# Altium project PCB_Project_Wireless Temp.PrjPcb
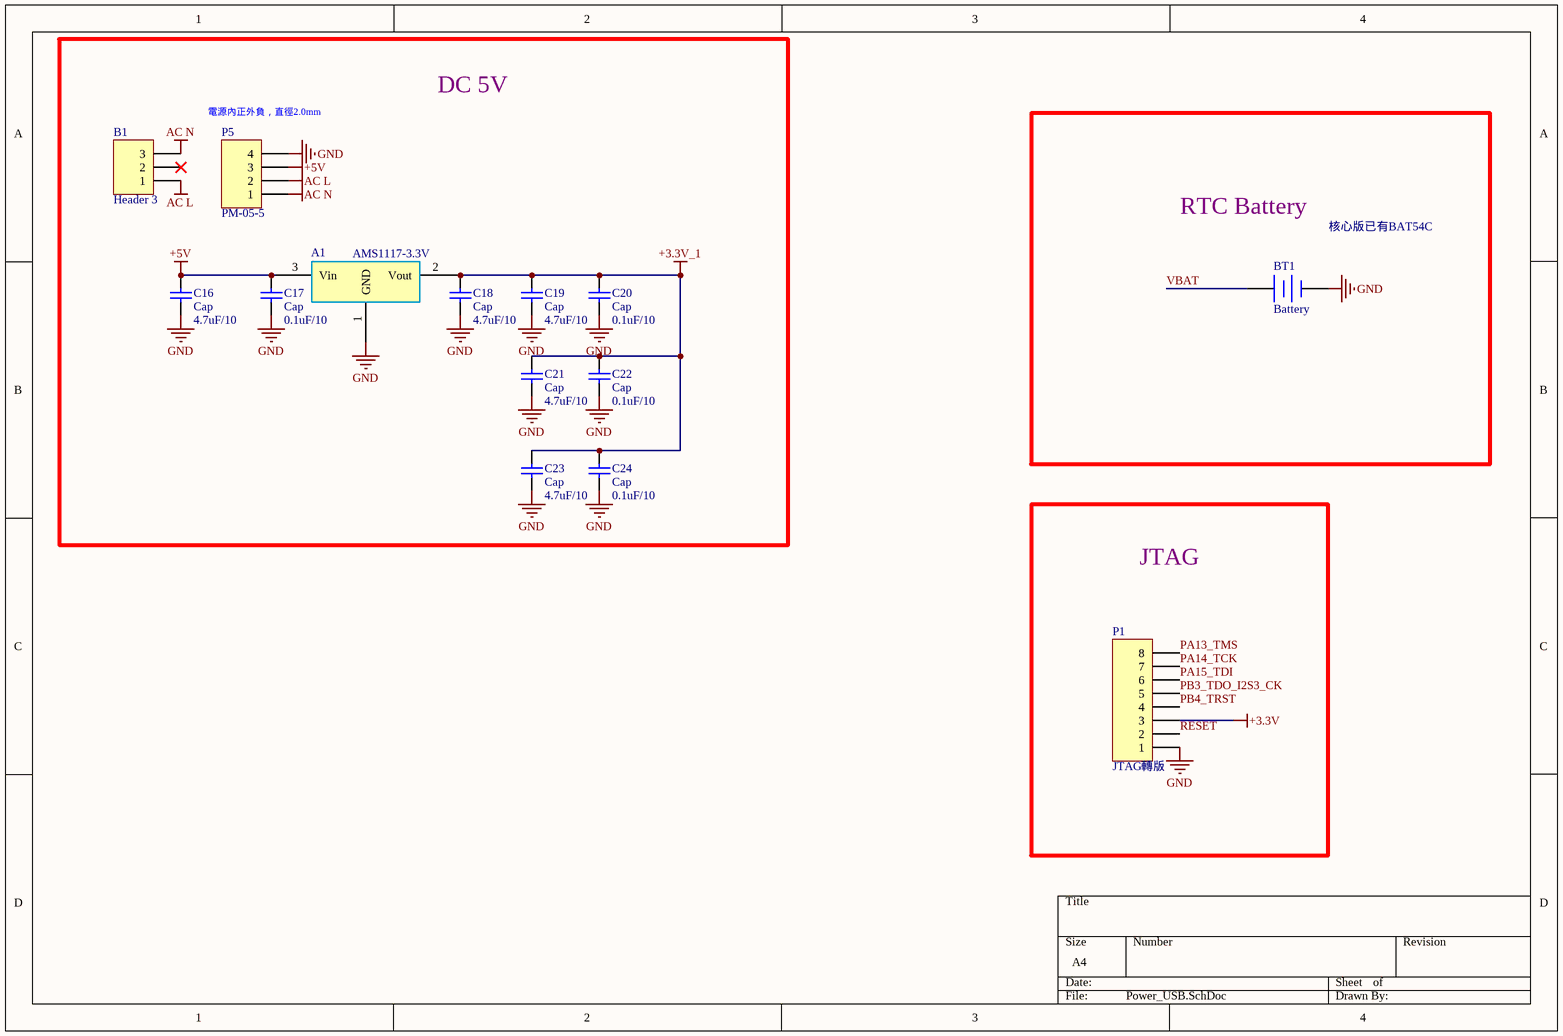
[diagram p0: Power_USB.SchDoc]
5 sheets, 74 parts. Net scope: global (net labels, ports and power ports of the same name join across sheets).
Board file: Wireless Temp PCB.PcbDoc
Sheets:
  Power_USB.SchDoc
  main.SchDoc
  LCD_Button_LED.SchDoc
  RS232_485_SDcard.SchDoc
  LwIP.SchDoc

## Sheet Power_USB.SchDoc
size A4; PageSetup: Record=PageOptions|CenterHorizontal=True|CenterVertical=True|PrintScale=0.91|XCorrection=1.00|YCorrection=1.00|PrintKind=1|BorderSize=5000000|LeftOffset=0|BottomOffset=0|Orientation=2|PaperLength=1000|PaperWidth=1000|Scale=100|PaperSource=15|PrintQuality=600|MediaType=1|DitherType=10|PrintScaleMode=1|PaperKind=Letter

### Parts
A1  AMS1117-3.3V  [AMS1117-3.3]
B1  Header 3  [歐式端子*3p]
BT1  Battery  [CR1220 battery holder]
C16  Cap  value 4.7uF/10  [0805]
C17  Cap  value 0.1uF/10  [0805]
C18  Cap  value 4.7uF/10  [0805]
C19  Cap  value 4.7uF/10  [0805]
C20  Cap  value 0.1uF/10  [0805]
C21  Cap  value 4.7uF/10  [0805]
C22  Cap  value 0.1uF/10  [0805]
C23  Cap  value 4.7uF/10  [0805]
C24  Cap  value 0.1uF/10  [0805]
P1  JTAG轉版  [HDR1X8]
P5  PM-05-5  [MW PM-05-5]

### Blocks framed on the sheet
DC 5V: A1 B1 C16-C24 P5
RTC Battery: BT1
JTAG: P1

### Nets
+3.3V: P1.3
+3.3V_1: A1.2(Vout) C18.1 C19.1 C20.1 C21.1 C22.1 C23.1 C24.1
+5V: A1.3(Vin) C16.1 C17.1 P5.3  [project net R1_V]
AC L: B1.1 P5.2
AC N: B1.3 P5.1
GND: A1.1(GND) BT1.2(-) C16.2 C17.2 C18.2 C19.2 C20.2 C21.2 C22.2 C23.2 C24.2 P1.1 P5.4
PA13_TMS: P1.8
PA14_TCK: P1.7
PA15_TDI: P1.6
PB3_TDO_I2S3_CK: P1.5
PB4_TRST: P1.4
RESET: P1.2
VBAT: BT1.1(+)

Not connected (* = marked no-connect by the designer): B1 2*

### Notes on the sheet
- (near P5) 電源內正外負，直徑2.0mm
- 核心版已有BAT54C

### Library data of the parts
B1 = Header 3: Header, 3-Pin; LatestRevisionDate: 17-Jul-2002; LatestRevisionNote: Re-released for DXP Platform.; Publisher: Altium Limited
BT1 = Battery: Multicell Battery; Published: 24-Mar-1999; LatestRevisionDate: 17-Jul-2002; LatestRevisionNote: Re-released for DXP Platform.; PackageReference: BAT-2; Publisher: Altium Limited; PackageDescription: Battery; 2 Leads
C16-C24 = Cap: Capacitor; Published: 8-Jun-2000; LatestRevisionDate: 17-Jul-2002; LatestRevisionNote: Re-released for DXP Platform.; PackageReference: RAD-0.3; Publisher: Altium Limited; PackageDescription: Radial Cap, Thru-Hole; 2 Leads; 0.3 in Pin Spacing
P1 = Header 8: Header, 8-Pin; LatestRevisionDate: 17-Jul-2002; LatestRevisionNote: Re-released for DXP Platform.; Publisher: Altium Limited
P5 = Header 4: Header, 4-Pin; LatestRevisionDate: 17-Jul-2002; LatestRevisionNote: Re-released for DXP Platform.; Publisher: Altium Limited

## Sheet main.SchDoc
size A4
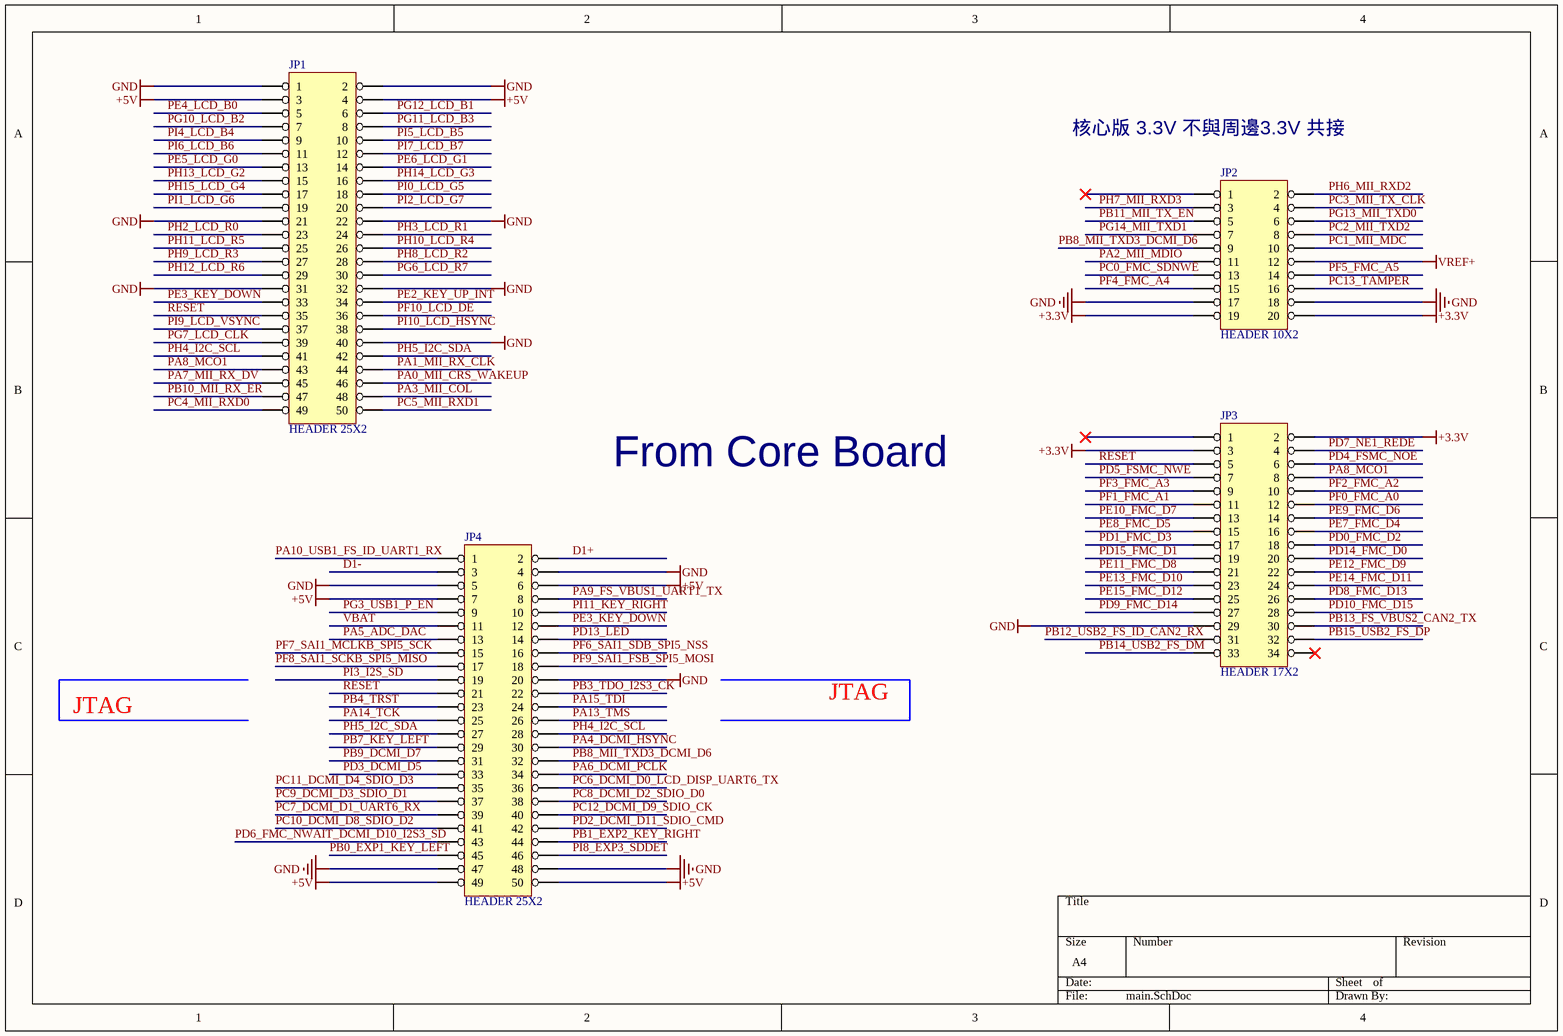
[diagram p1: main.SchDoc]

### Parts
JP1  HEADER 25X2  [SIP-50-1.27-SMD]
JP2  HEADER 10X2  [SIP-20-1.27-SMD]
JP3  HEADER 17X2  [SIP-34-1.27-SMD]
JP4  HEADER 25X2  [SIP-50-1.27-SMD]

### Nets
+3.3V: JP2.19 JP2.20 JP3.2 JP3.3
+5V: JP1.3 JP1.4 JP4.6 JP4.7 JP4.49 JP4.50  [project net R1_V]
GND: JP1.1 JP1.2 JP1.21 JP1.22 JP1.31 JP1.32 JP1.40 JP2.17 JP2.18 JP3.29 JP4.4 JP4.5 JP4.20 JP4.47 JP4.48
VREF+: JP2.12
D1+: JP4.2
D1-: JP4.3
PA0_MII_CRS_WAKEUP: JP1.46
PA1_MII_RX_CLK: JP1.44
PA2_MII_MDIO: JP2.11
PA3_MII_COL: JP1.48
PA4_DCMI_HSYNC: JP4.30
PA5_ADC_DAC: JP4.13
PA6_DCMI_PCLK: JP4.34
PA7_MII_RX_DV: JP1.45
PA8_MCO1: JP1.43 JP3.8
PA9_FS_VBUS1_UART1_TX: JP4.8
PA10_USB1_FS_ID_UART1_RX: JP4.1
PA13_TMS: JP4.26
PA14_TCK: JP4.25
PA15_TDI: JP4.24
PB0_EXP1_KEY_LEFT: JP4.45
PB1_EXP2_KEY_RIGHT: JP4.44
PB3_TDO_I2S3_CK: JP4.22
PB4_TRST: JP4.23
PB7_KEY_LEFT: JP4.29
PB8_MII_TXD3_DCMI_D6: JP2.9 JP4.32
PB9_DCMI_D7: JP4.31
PB10_MII_RX_ER: JP1.47
PB11_MII_TX_EN: JP2.5
PB12_USB2_FS_ID_CAN2_RX: JP3.31
PB13_FS_VBUS2_CAN2_TX: JP3.30
PB14_USB2_FS_DM: JP3.33
PB15_USB2_FS_DP: JP3.32
PC0_FMC_SDNWE: JP2.13
PC1_MII_MDC: JP2.10
PC2_MII_TXD2: JP2.8
PC3_MII_TX_CLK: JP2.4
PC4_MII_RXD0: JP1.49
PC5_MII_RXD1: JP1.50
PC6_DCMI_D0_LCD_DISP_UART6_TX: JP4.36
PC7_DCMI_D1_UART6_RX: JP4.39
PC8_DCMI_D2_SDIO_D0: JP4.38
PC9_DCMI_D3_SDIO_D1: JP4.37
PC10_DCMI_D8_SDIO_D2: JP4.41
PC11_DCMI_D4_SDIO_D3: JP4.35
PC12_DCMI_D9_SDIO_CK: JP4.40
PC13_TAMPER: JP2.16
PD0_FMC_D2: JP3.18
PD1_FMC_D3: JP3.17
PD2_DCMI_D11_SDIO_CMD: JP4.42
PD3_DCMI_D5: JP4.33
PD4_FSMC_NOE: JP3.6
PD5_FSMC_NWE: JP3.7
PD6_FMC_NWAIT_DCMI_D10_I2S3_SD: JP4.43
PD7_NE1_REDE: JP3.4
PD8_FMC_D13: JP3.26
PD9_FMC_D14: JP3.27
PD10_FMC_D15: JP3.28
PD13_LED: JP4.14
PD14_FMC_D0: JP3.20
PD15_FMC_D1: JP3.19
PE2_KEY_UP_INT: JP1.34
PE3_KEY_DOWN: JP1.33 JP4.12
PE4_LCD_B0: JP1.5
PE5_LCD_G0: JP1.13
PE6_LCD_G1: JP1.14
PE7_FMC_D4: JP3.16
PE8_FMC_D5: JP3.15
PE9_FMC_D6: JP3.14
PE10_FMC_D7: JP3.13
PE11_FMC_D8: JP3.21
PE12_FMC_D9: JP3.22
PE13_FMC_D10: JP3.23
PE14_FMC_D11: JP3.24
PE15_FMC_D12: JP3.25
PF0_FMC_A0: JP3.12
PF1_FMC_A1: JP3.11
PF2_FMC_A2: JP3.10
PF3_FMC_A3: JP3.9
PF4_FMC_A4: JP2.15
PF5_FMC_A5: JP2.14
PF6_SAI1_SDB_SPI5_NSS: JP4.16
PF7_SAI1_MCLKB_SPI5_SCK: JP4.15
PF8_SAI1_SCKB_SPI5_MISO: JP4.17
PF9_SAI1_FSB_SPI5_MOSI: JP4.18
PF10_LCD_DE: JP1.36
PG3_USB1_P_EN: JP4.9
PG6_LCD_R7: JP1.30
PG7_LCD_CLK: JP1.39
PG10_LCD_B2: JP1.7
PG11_LCD_B3: JP1.8
PG12_LCD_B1: JP1.6
PG13_MII_TXD0: JP2.6
PG14_MII_TXD1: JP2.7
PH2_LCD_R0: JP1.23
PH3_LCD_R1: JP1.24
PH4_I2C_SCL: JP1.41 JP4.28
PH5_I2C_SDA: JP1.42 JP4.27
PH6_MII_RXD2: JP2.2
PH7_MII_RXD3: JP2.3
PH8_LCD_R2: JP1.28
PH9_LCD_R3: JP1.27
PH10_LCD_R4: JP1.26
PH11_LCD_R5: JP1.25
PH12_LCD_R6: JP1.29
PH13_LCD_G2: JP1.15
PH14_LCD_G3: JP1.16
PH15_LCD_G4: JP1.17
PI0_LCD_G5: JP1.18
PI1_LCD_G6: JP1.19
PI2_LCD_G7: JP1.20
PI3_I2S_SD: JP4.19
PI4_LCD_B4: JP1.9
PI5_LCD_B5: JP1.10
PI6_LCD_B6: JP1.11
PI7_LCD_B7: JP1.12
PI8_EXP3_SDDET: JP4.46
PI9_LCD_VSYNC: JP1.37
PI10_LCD_HSYNC: JP1.38
PI11_KEY_RIGHT: JP4.10
RESET: JP1.35 JP3.5 JP4.21
VBAT: JP4.11

Not connected (* = marked no-connect by the designer): JP2 1*; JP3 1* 34*

### Notes on the sheet
- 核心版 3.3V 不與周邊3.3V 共接
- From Core Board
- JTAG

## Sheet LCD_Button_LED.SchDoc
size A4
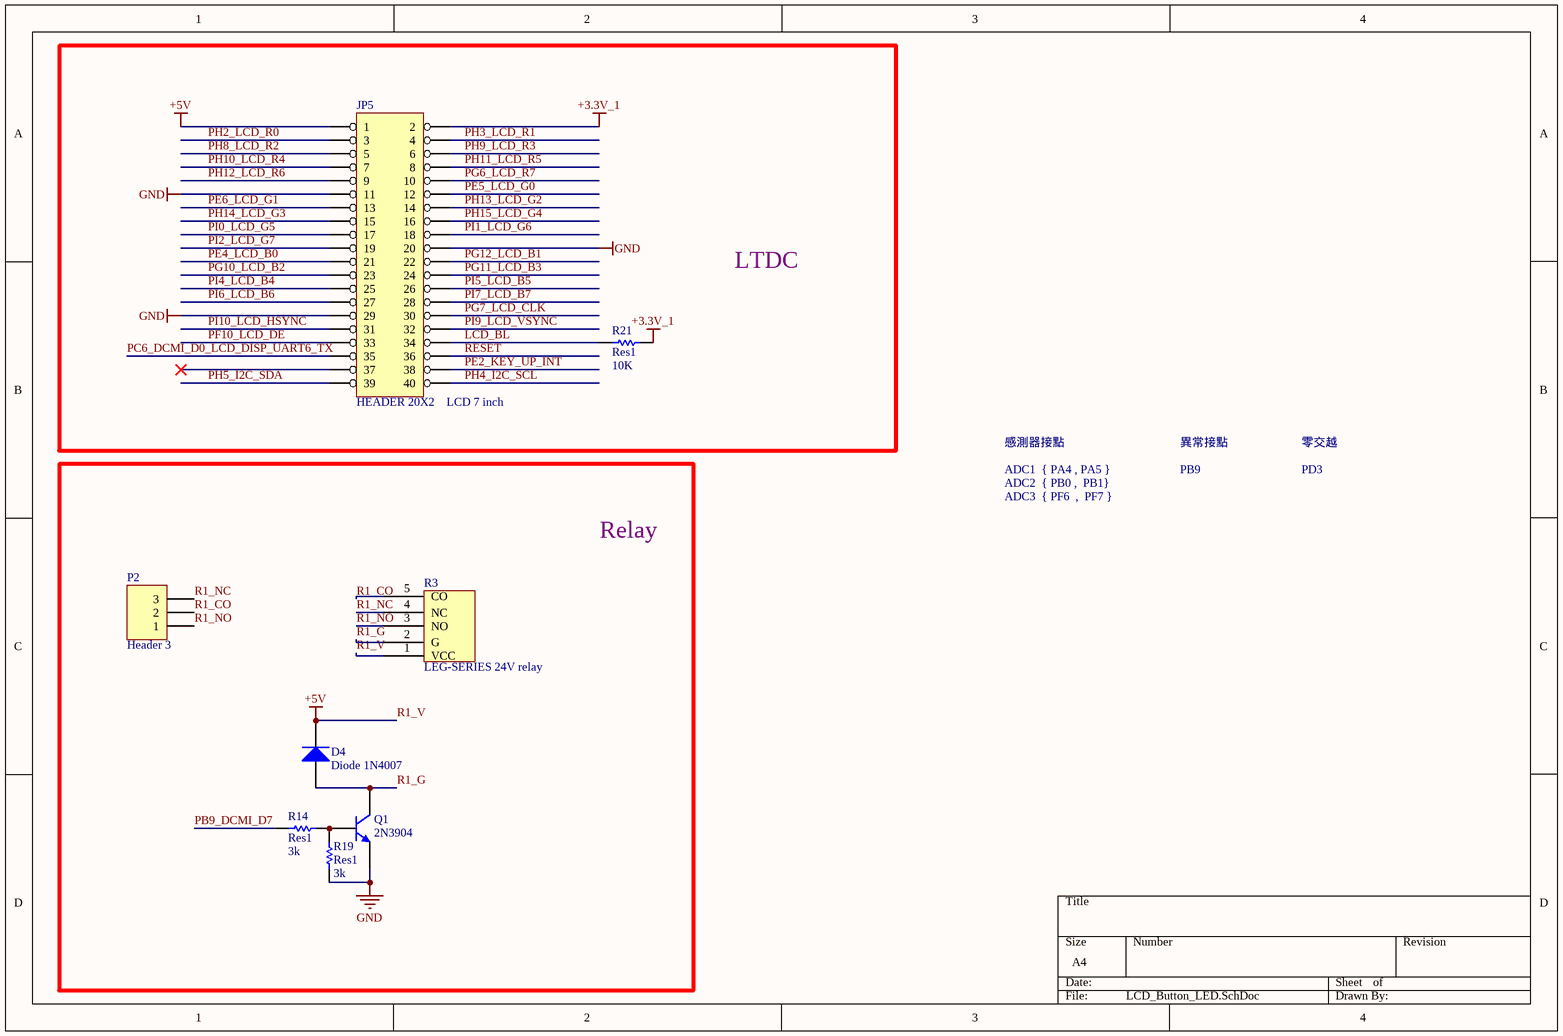
[diagram p2: LCD_Button_LED.SchDoc]

### Parts
D4  Diode 1N4007  [DO-41]
JP5  HEADER 20X2    LCD 7 inch  [HDR2X20]
P2  Header 3  [歐式端子*3p]
Q1  2N3904  [TO-92A]
R3  LEG-SERIES 24V relay  [LEG-SERIES 5V]
R14  Res1  value 3k  [0805_C]
R19  Res1  value 3k  [0805_C]
R21  Res1  value 10K  [0805_C]

### Blocks framed on the sheet
LTDC: JP5 R21
Relay: D4 P2 Q1 R3 R14 R19

### Nets
+3.3V_1: JP5.2 R21.1
GND: JP5.11 JP5.20 JP5.29 Q1.1(E) R19.1
R1_V: D4.2(K) JP5.1 R3.1(VCC)  [also labelled +5V]
LCD_BL: JP5.34 R21.2
PB9_DCMI_D7: R14.1
PC6_DCMI_D0_LCD_DISP_UART6_TX: JP5.35
PE2_KEY_UP_INT: JP5.38
PE4_LCD_B0: JP5.21
PE5_LCD_G0: JP5.12
PE6_LCD_G1: JP5.13
PF10_LCD_DE: JP5.33
PG6_LCD_R7: JP5.10
PG7_LCD_CLK: JP5.30
PG10_LCD_B2: JP5.23
PG11_LCD_B3: JP5.24
PG12_LCD_B1: JP5.22
PH2_LCD_R0: JP5.3
PH3_LCD_R1: JP5.4
PH4_I2C_SCL: JP5.40
PH5_I2C_SDA: JP5.39
PH8_LCD_R2: JP5.5
PH9_LCD_R3: JP5.6
PH10_LCD_R4: JP5.7
PH11_LCD_R5: JP5.8
PH12_LCD_R6: JP5.9
PH13_LCD_G2: JP5.14
PH14_LCD_G3: JP5.15
PH15_LCD_G4: JP5.16
PI0_LCD_G5: JP5.17
PI1_LCD_G6: JP5.18
PI2_LCD_G7: JP5.19
PI4_LCD_B4: JP5.25
PI5_LCD_B5: JP5.26
PI6_LCD_B6: JP5.27
PI7_LCD_B7: JP5.28
PI9_LCD_VSYNC: JP5.32
PI10_LCD_HSYNC: JP5.31
R1_CO: P2.2 R3.5(CO)
R1_G: D4.1(A) Q1.3(C) R3.2(G)
R1_NC: P2.3 R3.4(NC)
R1_NO: P2.1 R3.3(NO)
RESET: JP5.36
NetQ1_2: Q1.2(B) R14.2 R19.2

Not connected (* = marked no-connect by the designer): JP5 37*

### Notes on the sheet
- 感測器接點
- 異常接點
- 零交越
- ADC1  { PA4 , PA5 }
- ADC3  { PF6  ,  PF7 }
- ADC2  { PB0 ,  PB1}
- PB9
- PD3

### Library data of the parts
D4 = Diode 1N914: High Conductance Fast Diode; Published: 8-Jun-2000; LatestRevisionDate: 17-Jul-2002; LatestRevisionNote: Re-released for DXP Platform.; DatasheetVersion: 1997; PackageReference: DO-35; Publisher: Altium Limited; Code_JEDEC: DO-204-AH; ComponentLink1Description: Manufacturer Link; ComponentLink1URL: http://www.fairchildsemi.com/; ComponentLink2Description: Datasheet; ComponentLink2URL: http://www.fairchildsemi.com/ds/1N%2F1N4448.pdf
JP5 = HEADER 20X2
P2 = Header 3: Header, 3-Pin; LatestRevisionDate: 17-Jul-2002; LatestRevisionNote: Re-released for DXP Platform.; Publisher: Altium Limited
Q1 = 2N3904: NPN General Purpose Amplifier; Published: 8-Jun-2000; LatestRevisionDate: 15-Jan-2003; LatestRevisionNote: PCB Footprint 'BCY-W3/D4.7' replaced; DatasheetVersion: 1997; PackageVersion: Sep-1998; PackageReference: TO-92A; Publisher: Altium Limited; Code_JEDEC: TO-92A; ComponentLink1Description: Manufacturer Link; ComponentLink1URL: http://www.fairchildsemi.com/; ComponentLink2Description: Datasheet; ComponentLink2URL: http://www.fairchildsemi.com/ds/2N%2F2N3904.pdf
R3 = LEG-SERIES 5V relay
R14 R19 R21 = Res1: Resistor; Published: 8-Jun-2000; LatestRevisionDate: 17-Jul-2002; LatestRevisionNote: Re-released for DXP Platform.; PackageReference: AXIAL-0.3; Publisher: Altium Limited
  R21: PackageDescription: Axial Device, Thru-Hole; 2 Leads; 0.3 in Pin Spacing

## Sheet RS232_485_SDcard.SchDoc
size A4
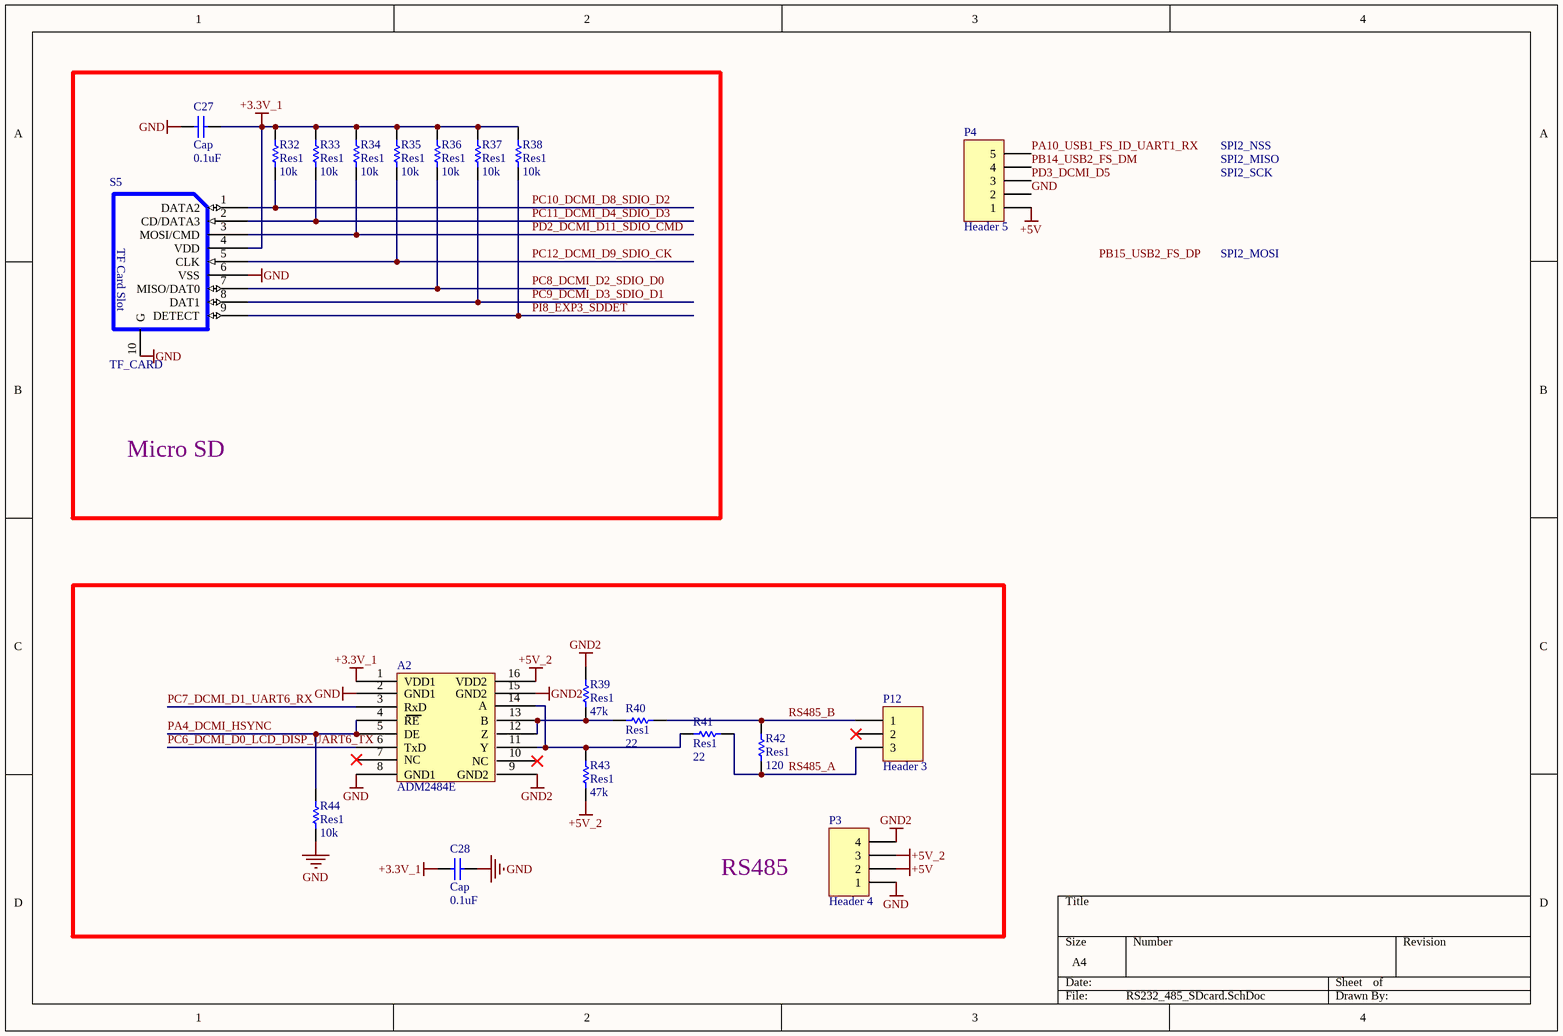
[diagram p3: RS232_485_SDcard.SchDoc]

### Parts
A2  ADM2484E  [RW-16]
C27  Cap  value 0.1uF  [0805_C]
C28  Cap  value 0.1uF  [0805_C]
P3  Header 4  [B0505S-1W]
P4  Header 5  [DIN 固定座 方型 5P TO PCB 2003]
P12  Header 3  [歐式端子*3p]
R32  Res1  value 10k  [0805_C]
R33  Res1  value 10k  [0805_C]
R34  Res1  value 10k  [0805_C]
R35  Res1  value 10k  [0805_C]
R36  Res1  value 10k  [0805_C]
R37  Res1  value 10k  [0805_C]
R38  Res1  value 10k  [0805_C]
R39  Res1  value 47k  [0805_C]
R40  Res1  value 22  [0805_C]
R41  Res1  value 22  [0805_C]
R42  Res1  value 120  [0805_C]
R43  Res1  value 47k  [0805_C]
R44  Res1  value 10k  [0805_C]
S5  TF_CARD  [TF-CARD]

### Blocks framed on the sheet
Micro SD: C27 R32-R38 S5
RS485: A2 C28 P3 P12 R39-R44

### Nets
+3.3V_1: A2.1(VDD1) C27.1 C28.1 R32.1 R33.1 R34.1 R35.1 R36.1 R37.1 R38.1 S5.4(VDD)
+5V: P3.2 P4.1  [project net R1_V]
+5V_2: A2.16(VDD2) P3.3 R43.2
GND: A2.2(GND1) A2.8(GND1) C27.2 C28.2 P3.1 P4.2 R44.1 S5.6(VSS) S5.10(G)
GND2: A2.9(GND2) A2.15(GND2) P3.4 R39.1
PA4_DCMI_HSYNC: A2.4(RE) A2.5(DE) R44.2
PA10_USB1_FS_ID_UART1_RX: P4.5
PB14_USB2_FS_DM: P4.4
PC6_DCMI_D0_LCD_DISP_UART6_TX: A2.6(TxD)
PC7_DCMI_D1_UART6_RX: A2.3(RxD)
PC8_DCMI_D2_SDIO_D0: R36.2 S5.7(MISO/DAT0)
PC9_DCMI_D3_SDIO_D1: R37.2 S5.8(DAT1)
PC10_DCMI_D8_SDIO_D2: R32.2 S5.1(DATA2)
PC11_DCMI_D4_SDIO_D3: R33.2 S5.2(CD/DATA3)
PC12_DCMI_D9_SDIO_CK: R35.2 S5.5(CLK)
PD2_DCMI_D11_SDIO_CMD: R34.2 S5.3(MOSI/CMD)
PD3_DCMI_D5: P4.3
PI8_EXP3_SDDET: R38.2 S5.9(DETECT)
RS485_A: P12.3 R41.1 R42.2
RS485_B: P12.1 R40.1 R42.1
NetA2_11: A2.11(Y) A2.14(A) R41.2 R43.1
NetA2_12: A2.12(Z) A2.13(B) R39.2 R40.2

Not connected (* = marked no-connect by the designer): A2 7(NC)* 10(NC)*; P12 2*

### Notes on the sheet
- SPI2_NSS
- SPI2_MISO
- SPI2_SCK
- SPI2_MOSI
- Labels drawn without touching a wire or pin: PB15_USB2_FS_DP
- (in symbol TF_CARD) TF Card Slot

### Library data of the parts
C27 C28 = Cap: Capacitor; Published: 8-Jun-2000; LatestRevisionDate: 17-Jul-2002; LatestRevisionNote: Re-released for DXP Platform.; PackageReference: RAD-0.3; Publisher: Altium Limited; PackageDescription: Radial Cap, Thru-Hole; 2 Leads; 0.3 in Pin Spacing
P3 = Header 4: Header, 4-Pin; LatestRevisionDate: 17-Jul-2002; LatestRevisionNote: Re-released for DXP Platform.; Publisher: Altium Limited
P4 = Header 5: Header, 5-Pin; LatestRevisionDate: 17-Jul-2002; LatestRevisionNote: Re-released for DXP Platform.; Publisher: Altium Limited
P12 = Header 3: Header, 3-Pin; LatestRevisionDate: 17-Jul-2002; LatestRevisionNote: Re-released for DXP Platform.; Publisher: Altium Limited
R32-R44 = Res1: Resistor; Published: 8-Jun-2000; LatestRevisionDate: 17-Jul-2002; LatestRevisionNote: Re-released for DXP Platform.; PackageReference: AXIAL-0.3; Publisher: Altium Limited; PackageDescription: Axial Device, Thru-Hole; 2 Leads; 0.3 in Pin Spacing

## Sheet LwIP.SchDoc
size A4
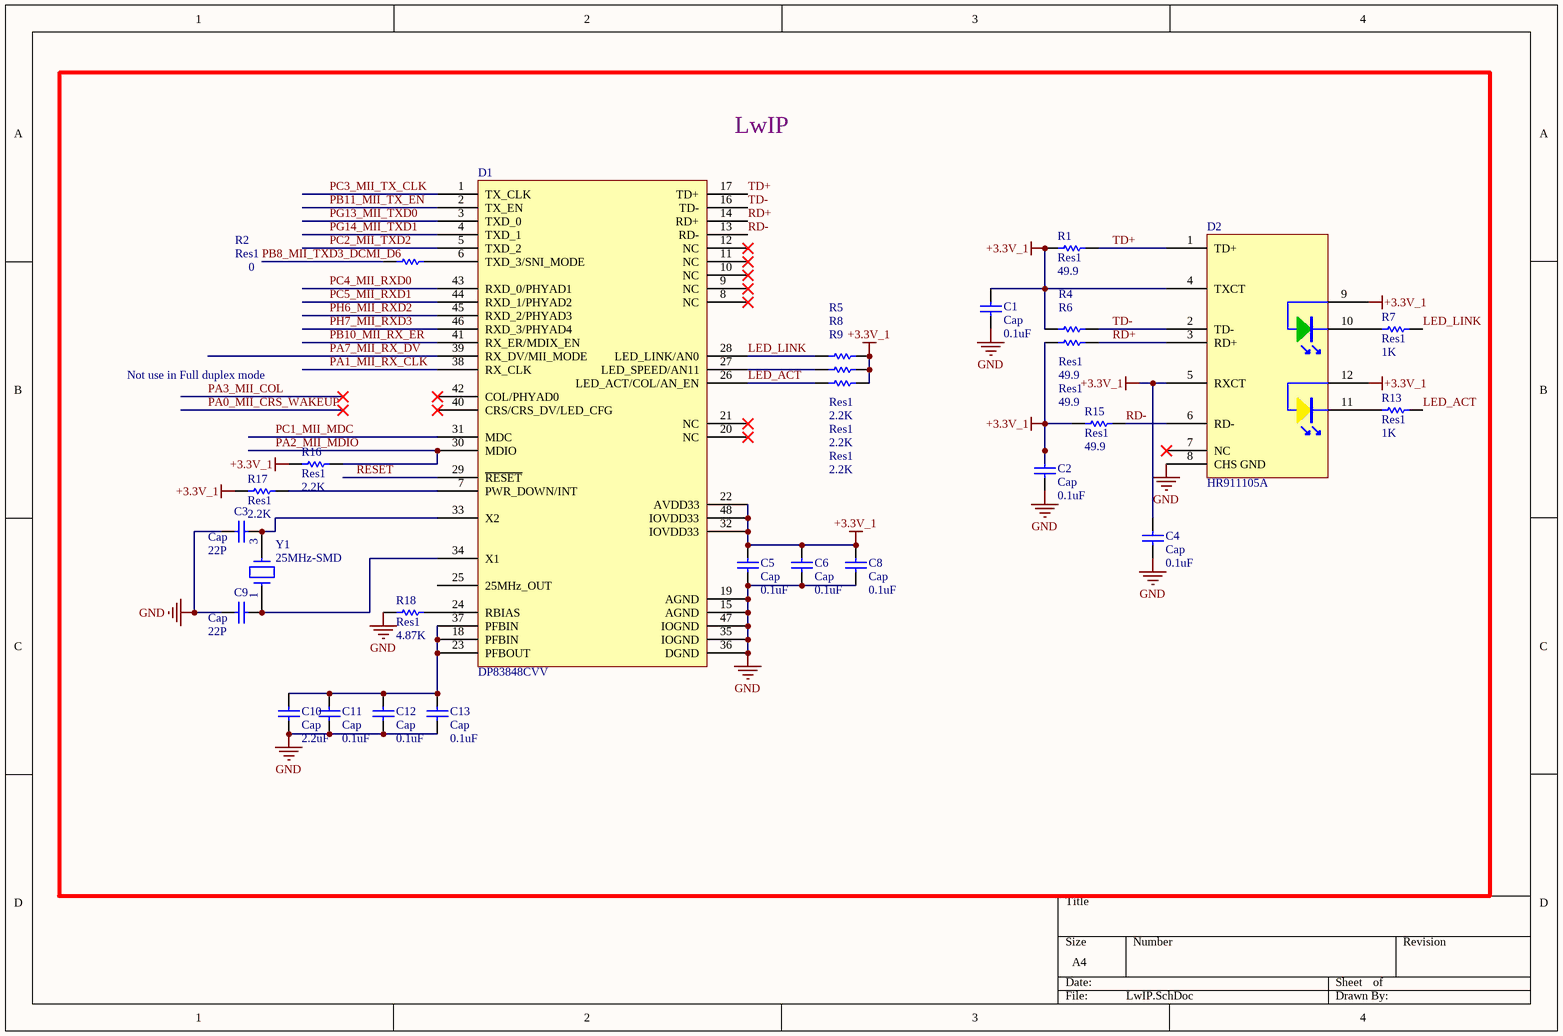
[diagram p4: LwIP.SchDoc]

### Parts
C1  Cap  value 0.1uF  [0805_C]
C2  Cap  value 0.1uF  [0805_C]
C3  Cap  value 22P  [0805_C]
C4  Cap  value 0.1uF  [0805_C]
C5  Cap  value 0.1uF  [0805_C]
C6  Cap  value 0.1uF  [0805_C]
C8  Cap  value 0.1uF  [0805_C]
C9  Cap  value 22P  [0805_C]
C10  Cap  value 2.2uF  [0805_C]
C11  Cap  value 0.1uF  [0805_C]
C12  Cap  value 0.1uF  [0805_C]
C13  Cap  value 0.1uF  [0805_C]
D1  DP83848CVV  [LQFP48]
D2  HR911105A  [RJ45-LED]
R1  Res1  value 49.9  [0805_C]
R2  Res1  value 0  [0805_C]
R4  Res1  value 49.9  [0805_C]
R5  Res1  value 2.2K  [0805_C]
R6  Res1  value 49.9  [0805_C]
R7  Res1  value 1K  [0805_C]
R8  Res1  value 2.2K  [0805_C]
R9  Res1  value 2.2K  [0805_C]
R13  Res1  value 1K  [0805_C]
R15  Res1  value 49.9  [0805_C]
R16  Res1  value 2.2K  [0805_C]
R17  Res1  value 2.2K  [0805_C]
R18  Res1  value 4.87K  [0805_C]
Y1  25MHz-SMD  [XTAL-3225]

### Nets
+3.3V_1: C1.1 C2.1 C4.1 C5.1 C6.1 C8.1 D1.22(AVDD33) D1.32(IOVDD33) D1.48(IOVDD33) D2.4(TXCT) D2.5(RXCT) D2.9 D2.12 R1.1 R4.1 R5.2 R6.1 R8.2 R9.2 R15.1 R16.2 R17.2
GND: C1.2 C2.2 C3.1 C4.2 C5.2 C6.2 C8.2 C9.1 C10.2 C11.2 C12.2 C13.2 D1.15(AGND) D1.19(AGND) D1.35(IOGND) D1.36(DGND) D1.47(IOGND) D2.8(CHS_GND) R18.2
LED_ACT: D1.26(LED_ACT/COL/AN_EN) R9.1 R13.2
LED_LINK: D1.28(LED_LINK/AN0) R5.1 R7.2
PA1_MII_RX_CLK: D1.38(RX_CLK)
PA2_MII_MDIO: D1.30(MDIO) R16.1
PA7_MII_RX_DV: D1.39(RX_DV/MII_MODE)
PB8_MII_TXD3_DCMI_D6: R2.1
PB10_MII_RX_ER: D1.41(RX_ER/MDIX_EN)
PB11_MII_TX_EN: D1.2(TX_EN)
PC1_MII_MDC: D1.31(MDC)
PC2_MII_TXD2: D1.5(TXD_2)
PC3_MII_TX_CLK: D1.1(TX_CLK)
PC4_MII_RXD0: D1.43(RXD_0/PHYAD1)
PC5_MII_RXD1: D1.44(RXD_1/PHYAD2)
PG13_MII_TXD0: D1.3(TXD_0)
PG14_MII_TXD1: D1.4(TXD_1)
PH6_MII_RXD2: D1.45(RXD_2/PHYAD3)
PH7_MII_RXD3: D1.46(RXD_3/PHYAD4)
RD+: D1.14(RD+) D2.3(RD+) R6.2
RD-: D1.13(RD-) D2.6(RD-) R15.2
RESET: D1.29(~{RESET})
TD+: D1.17(TD+) D2.1(TD+) R1.2
TD-: D1.16(TD-) D2.2(TD-) R4.2
NetC3_2: C3.2 D1.33(X2) Y1.3
NetC9_2: C9.2 D1.34(X1) Y1.1
NetC10_1: C10.1 C11.1 C12.1 C13.1 D1.18(PFBIN) D1.23(PFBOUT) D1.37(PFBIN)
NetD1_6: D1.6(TXD_3/SNI_MODE) R2.2
NetD1_7: D1.7(PWR_DOWN/INT) R17.1
NetD1_24: D1.24(RBIAS) R18.1
NetD1_27: D1.27(LED_SPEED/AN11) R8.1
NetD2_10: D2.10 R7.1
NetD2_11: D2.11 R13.1

Not connected (* = marked no-connect by the designer): D1 8(NC)* 9(NC)* 10(NC)* 11(NC)* 12(NC)* 20(NC)* 21(NC)* 25(25MHz_OUT) 40(CRS/CRS_DV/LED_CFG)* 42(COL/PHYAD0)*; D2 7(NC)*

### Notes on the sheet
- LwIP
- Not use in Full duplex mode

### Library data of the parts
C1-C6 C8-C13 = Cap: Capacitor; Published: 8-Jun-2000; LatestRevisionDate: 17-Jul-2002; LatestRevisionNote: Re-released for DXP Platform.; PackageReference: RAD-0.3; Publisher: Altium Limited; PackageDescription: Radial Cap, Thru-Hole; 2 Leads; 0.3 in Pin Spacing
R1 R2 R4-R9 R13 R15-R18 = Res1: Resistor; Published: 8-Jun-2000; LatestRevisionDate: 17-Jul-2002; LatestRevisionNote: Re-released for DXP Platform.; PackageReference: AXIAL-0.3; Publisher: Altium Limited; PackageDescription: Axial Device, Thru-Hole; 2 Leads; 0.3 in Pin Spacing
Y1 = CRYSTAL-SMD: Crystal

## Nets that join several sheets
+3.3V: Power_USB (P1.3), main (JP2.19 JP2.20 JP3.2 JP3.3)
+3.3V_1: Power_USB (8 pins), LCD_Button_LED (JP5.2 R21.1), RS232_485_SDcard (11 pins), LwIP (22 pins)
GND: Power_USB (13 pins), main (15 pins), LCD_Button_LED (5 pins), RS232_485_SDcard (9 pins), LwIP (19 pins)
R1_V: Power_USB (A1.3 C16.1 C17.1 P5.3), main (6 pins), LCD_Button_LED (D4.2 JP5.1 R3.1), RS232_485_SDcard (P3.2 P4.1)
PA1_MII_RX_CLK: main (JP1.44), LwIP (D1.38)
PA2_MII_MDIO: main (JP2.11), LwIP (D1.30 R16.1)
PA4_DCMI_HSYNC: main (JP4.30), RS232_485_SDcard (A2.4 A2.5 R44.2)
PA7_MII_RX_DV: main (JP1.45), LwIP (D1.39)
PA10_USB1_FS_ID_UART1_RX: main (JP4.1), RS232_485_SDcard (P4.5)
PA13_TMS: Power_USB (P1.8), main (JP4.26)
PA14_TCK: Power_USB (P1.7), main (JP4.25)
PA15_TDI: Power_USB (P1.6), main (JP4.24)
PB3_TDO_I2S3_CK: Power_USB (P1.5), main (JP4.22)
PB4_TRST: Power_USB (P1.4), main (JP4.23)
PB8_MII_TXD3_DCMI_D6: main (JP2.9 JP4.32), LwIP (R2.1)
PB9_DCMI_D7: main (JP4.31), LCD_Button_LED (R14.1)
PB10_MII_RX_ER: main (JP1.47), LwIP (D1.41)
PB11_MII_TX_EN: main (JP2.5), LwIP (D1.2)
PB14_USB2_FS_DM: main (JP3.33), RS232_485_SDcard (P4.4)
PC1_MII_MDC: main (JP2.10), LwIP (D1.31)
PC2_MII_TXD2: main (JP2.8), LwIP (D1.5)
PC3_MII_TX_CLK: main (JP2.4), LwIP (D1.1)
PC4_MII_RXD0: main (JP1.49), LwIP (D1.43)
PC5_MII_RXD1: main (JP1.50), LwIP (D1.44)
PC6_DCMI_D0_LCD_DISP_UART6_TX: main (JP4.36), LCD_Button_LED (JP5.35), RS232_485_SDcard (A2.6)
PC7_DCMI_D1_UART6_RX: main (JP4.39), RS232_485_SDcard (A2.3)
PC8_DCMI_D2_SDIO_D0: main (JP4.38), RS232_485_SDcard (R36.2 S5.7)
PC9_DCMI_D3_SDIO_D1: main (JP4.37), RS232_485_SDcard (R37.2 S5.8)
PC10_DCMI_D8_SDIO_D2: main (JP4.41), RS232_485_SDcard (R32.2 S5.1)
PC11_DCMI_D4_SDIO_D3: main (JP4.35), RS232_485_SDcard (R33.2 S5.2)
PC12_DCMI_D9_SDIO_CK: main (JP4.40), RS232_485_SDcard (R35.2 S5.5)
PD2_DCMI_D11_SDIO_CMD: main (JP4.42), RS232_485_SDcard (R34.2 S5.3)
PD3_DCMI_D5: main (JP4.33), RS232_485_SDcard (P4.3)
PE2_KEY_UP_INT: main (JP1.34), LCD_Button_LED (JP5.38)
PE4_LCD_B0: main (JP1.5), LCD_Button_LED (JP5.21)
PE5_LCD_G0: main (JP1.13), LCD_Button_LED (JP5.12)
PE6_LCD_G1: main (JP1.14), LCD_Button_LED (JP5.13)
PF10_LCD_DE: main (JP1.36), LCD_Button_LED (JP5.33)
PG6_LCD_R7: main (JP1.30), LCD_Button_LED (JP5.10)
PG7_LCD_CLK: main (JP1.39), LCD_Button_LED (JP5.30)
PG10_LCD_B2: main (JP1.7), LCD_Button_LED (JP5.23)
PG11_LCD_B3: main (JP1.8), LCD_Button_LED (JP5.24)
PG12_LCD_B1: main (JP1.6), LCD_Button_LED (JP5.22)
PG13_MII_TXD0: main (JP2.6), LwIP (D1.3)
PG14_MII_TXD1: main (JP2.7), LwIP (D1.4)
PH2_LCD_R0: main (JP1.23), LCD_Button_LED (JP5.3)
PH3_LCD_R1: main (JP1.24), LCD_Button_LED (JP5.4)
PH4_I2C_SCL: main (JP1.41 JP4.28), LCD_Button_LED (JP5.40)
PH5_I2C_SDA: main (JP1.42 JP4.27), LCD_Button_LED (JP5.39)
PH6_MII_RXD2: main (JP2.2), LwIP (D1.45)
PH7_MII_RXD3: main (JP2.3), LwIP (D1.46)
PH8_LCD_R2: main (JP1.28), LCD_Button_LED (JP5.5)
PH9_LCD_R3: main (JP1.27), LCD_Button_LED (JP5.6)
PH10_LCD_R4: main (JP1.26), LCD_Button_LED (JP5.7)
PH11_LCD_R5: main (JP1.25), LCD_Button_LED (JP5.8)
PH12_LCD_R6: main (JP1.29), LCD_Button_LED (JP5.9)
PH13_LCD_G2: main (JP1.15), LCD_Button_LED (JP5.14)
PH14_LCD_G3: main (JP1.16), LCD_Button_LED (JP5.15)
PH15_LCD_G4: main (JP1.17), LCD_Button_LED (JP5.16)
PI0_LCD_G5: main (JP1.18), LCD_Button_LED (JP5.17)
PI1_LCD_G6: main (JP1.19), LCD_Button_LED (JP5.18)
PI2_LCD_G7: main (JP1.20), LCD_Button_LED (JP5.19)
PI4_LCD_B4: main (JP1.9), LCD_Button_LED (JP5.25)
PI5_LCD_B5: main (JP1.10), LCD_Button_LED (JP5.26)
PI6_LCD_B6: main (JP1.11), LCD_Button_LED (JP5.27)
PI7_LCD_B7: main (JP1.12), LCD_Button_LED (JP5.28)
PI8_EXP3_SDDET: main (JP4.46), RS232_485_SDcard (R38.2 S5.9)
PI9_LCD_VSYNC: main (JP1.37), LCD_Button_LED (JP5.32)
PI10_LCD_HSYNC: main (JP1.38), LCD_Button_LED (JP5.31)
RESET: Power_USB (P1.2), main (JP1.35 JP3.5 JP4.21), LCD_Button_LED (JP5.36), LwIP (D1.29)
VBAT: Power_USB (BT1.1), main (JP4.11)